# Altium project nose_blink_fix.PrjPcb
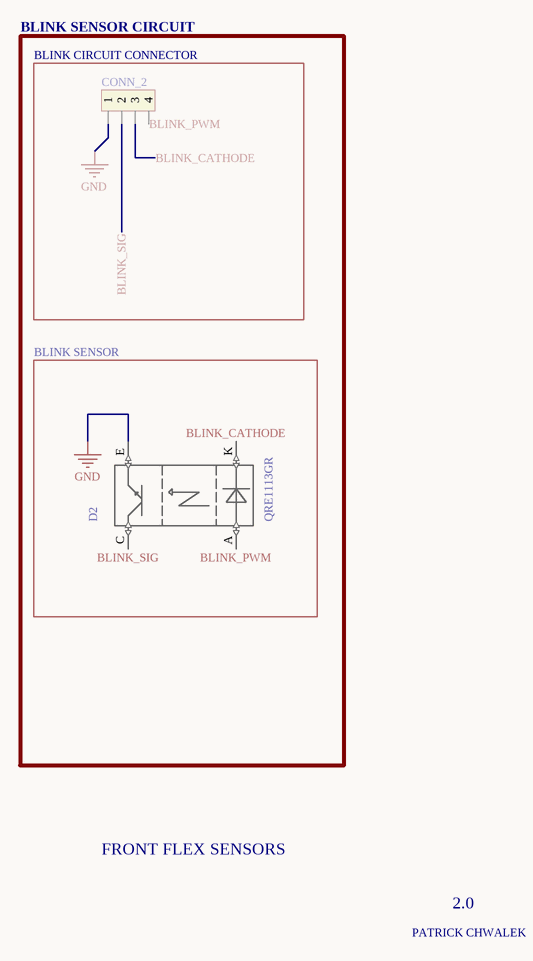
[diagram p0: nose_blink.SchDoc]
1 sheet, 2 parts. Net scope: global (net labels, ports and power ports of the same name join across sheets).
Board file: nose_blink.PcbDoc

## Sheet nose_blink.SchDoc
size A

### Parts
CONN_2  BLINK  [4_pos_1mm_header]  (value not drawn)
D2  QRE1113GR  [*4LEADSMD_QRE1113GR(Primary)]

### Blocks framed on the sheet
BLINK CIRCUIT CONNECTOR: CONN_2
BLINK SENSOR: D2

### Nets
GND: CONN_2.1 D2.E
BLINK_CATHODE: CONN_2.3 D2.K
BLINK_PWM: CONN_2.4 D2.A
BLINK_SIG: CONN_2.2 D2.C

### Notes on the sheet
- BLINK SENSOR CIRCUIT
- FRONT FLEX SENSORS
- 2.0
- PATRICK CHWALEK

### Library data of the parts
CONN_2 = 4_pin_1mm_header
D2 = QRE1113GR: QRE1113 Series 30 V 50 mA Miniature Reflective Object Sensor - SMD-4; MF: ON Semiconductor; Price: None; MP: QRE1113GR; SnapEDA_Link: https://www.snapeda.com/parts/QRE1113GR/ON%20Semiconductor/view-part/?ref=snap; Package: SMD-4 ON Semiconductor; Availability: Unavailable; Value: *